# EAGLE design delay_calibrator (EAGLE 9.2.2)
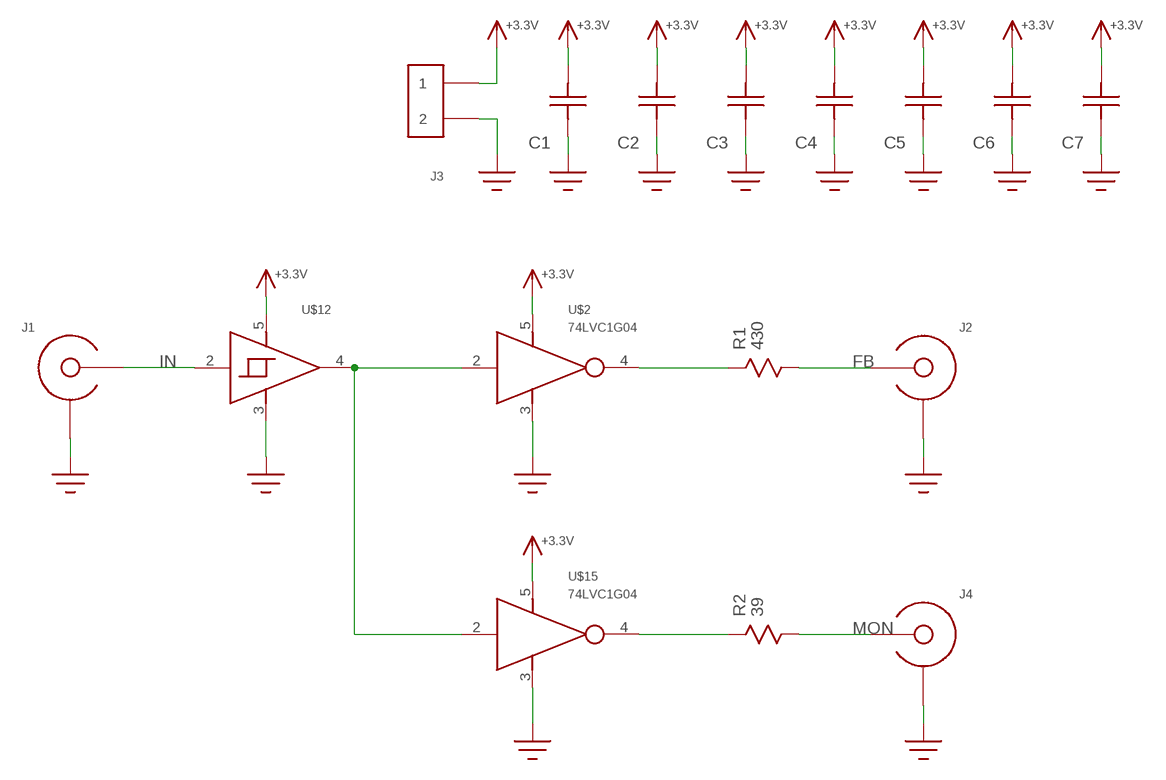
[diagram p0: schematic, sheet 1]

## Parts
C1  C1206  [1206]
C2  C0603  [C0603]
C3  C0603  [C0603]
C4  C0603  [C0603]
C5  C0603  [C0603]
C6  C0603  [C0603]
C7  C0603  [C0603]
J1  EDGE_LAUNCH_JACK  [EDGE_LAUNCH_RF_CON]
J2  EDGE_LAUNCH_JACK  [EDGE_LAUNCH_RF_CON]
J3  HEADER_2PIN  [HEADER_2PIN]
J4  EDGE_LAUNCH_JACK  [EDGE_LAUNCH_RF_CON]
R1  430  R0603  [R0603]
R2  39  R0603  [R0603]
U$2  74LVC1G04  [SOT23-5]
U$12  74LVC1G17  [SOT23-5]
U$15  74LVC1G04  [SOT23-5]

## Nets
+3.3V: C1.P$1 C2.P$1 C3.P$1 C4.P$1 C5.P$1 C6.P$1 C7.P$1 J3.1 U$2.5(VCC) U$12.5(VCC) U$15.5(VCC)
FB: J2.CENTER R1.P$2
GND: C1.P$2 C2.P$2 C3.P$2 C4.P$2 C5.P$2 C6.P$2 C7.P$2 J1.GND@1(SHIELD) J1.GND@2(SHIELD) J1.GND@3(SHIELD) J1.GND@4(SHIELD) J1.GND@5(SHIELD) J1.GND@6(SHIELD) J1.GND@7(SHIELD) J1.GND@8(SHIELD) J1.GND@9(SHIELD) J1.GND@10(SHIELD) J1.GND@11(SHIELD) J1.GND@12(SHIELD) J1.SHIELD@1(SHIELD) J1.SHIELD@2(SHIELD) J2.GND@1(SHIELD) J2.GND@2(SHIELD) J2.GND@3(SHIELD) J2.GND@4(SHIELD) J2.GND@5(SHIELD) J2.GND@6(SHIELD) J2.GND@7(SHIELD) J2.GND@8(SHIELD) J2.GND@9(SHIELD) J2.GND@10(SHIELD) J2.GND@11(SHIELD) J2.GND@12(SHIELD) J2.SHIELD@1(SHIELD) J2.SHIELD@2(SHIELD) J3.2 J4.GND@1(SHIELD) J4.GND@2(SHIELD) J4.GND@3(SHIELD) J4.GND@4(SHIELD) J4.GND@5(SHIELD) J4.GND@6(SHIELD) J4.GND@7(SHIELD) J4.GND@8(SHIELD) J4.GND@9(SHIELD) J4.GND@10(SHIELD) J4.GND@11(SHIELD) J4.GND@12(SHIELD) J4.SHIELD@1(SHIELD) J4.SHIELD@2(SHIELD) U$2.3(GND) U$12.3(GND) U$15.3(GND)
IN: J1.CENTER U$12.2(IN)
MON: J4.CENTER R2.P$2
N$3: R2.P$1 U$15.4(OUT)
N$4: R1.P$1 U$2.4(OUT)
N$7: U$2.2(IN) U$12.4(OUT) U$15.2(IN)

## Library data of the parts
C1-C7 = yapo:C
J1 J2 J4 = yapo:EDGE_LAUNCH_JACK
J3 = yapo:HEADER_2PIN
R1 R2 = yapo:R
U$2 U$15 = yapo:74LVC1G04
U$12 = yapo:74LVC1G17

## Board
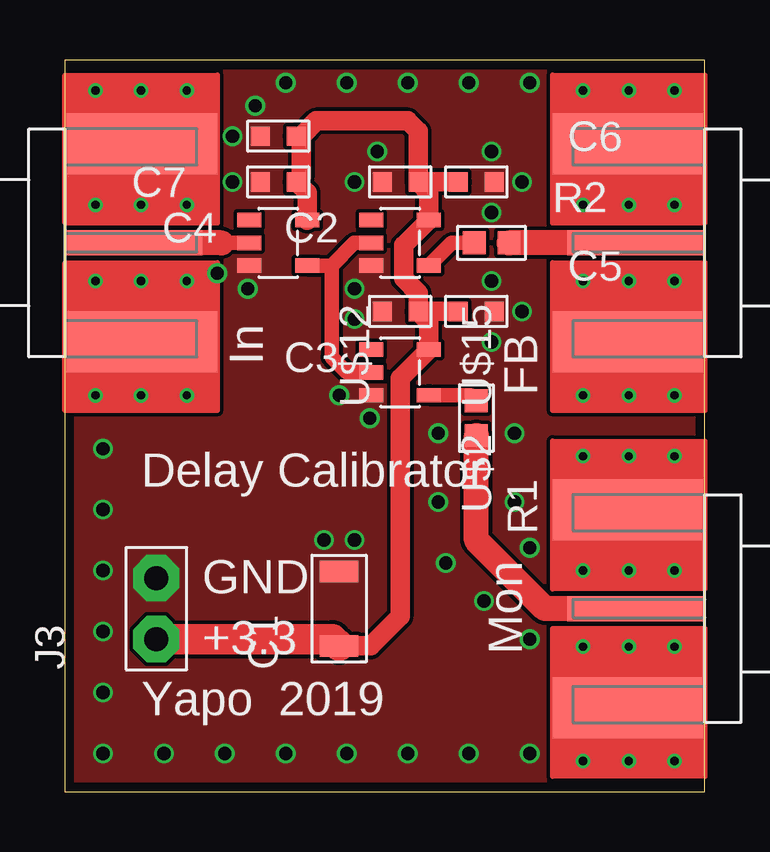
[diagram p1: board, top side]
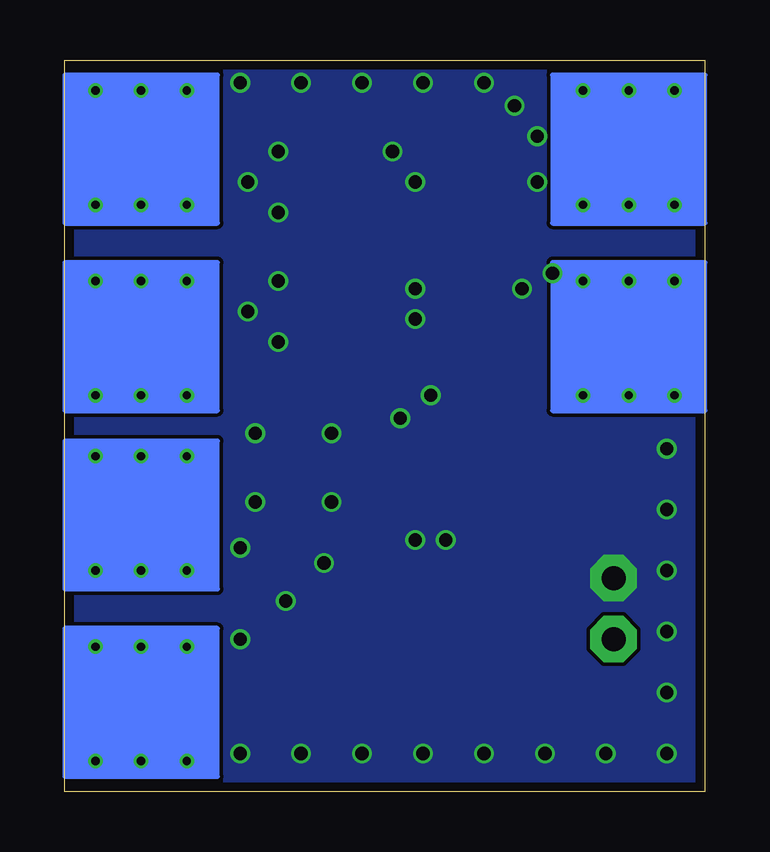
[diagram p2: board, bottom side, seen from below]

Size 26.67 x 30.48 mm. Coordinates in mm from the lower left corner, seen from the top.
Outline: 0,0 26.67,0 26.67,30.48 0,30.48 0,0
Copper layers (1*16): Top 0.035559375mm / dielectric 1.6mm / Bottom 0.035559375mm
Design rules "oshpark-2layer *": minimum track width 6mil, minimum drill 10mil, track to track 6mil, track to pad 6mil, pad to pad 6mil, via to via 6mil, smd to smd 6mil, copper to edge 15mil, drill to drill 6mil, minimum pad ring 5mil, minimum via ring 5mil, stop-mask expansion 2.5mil, vias tented up to drill 30mil, thermal gap 10mil

### Footprints (pad centres in the part's own frame; a part is rotated, then mirrored left to right if it is on the bottom)
1206 = smd 0.9 x 1.6: P$1 -1.55,0; P$2 1.55,0
C0603 = smd 0.8 x 0.8: P$1 -0.75,0; P$2 0.75,0
EDGE_LAUNCH_RF_CON = smd 5.715 x 1.041: CENTER -2.875,0 | drill 0.35: GND@1 -5.08,1.587; GND@2 -3.175,1.587; GND@3 -1.27,1.587; GND@4 -5.08,-1.587; GND@5 -3.175,-1.587; GND@6 -1.27,-1.587; GND@7 -5.08,6.35; GND@8 -3.175,6.35; GND@9 -1.27,6.35; GND@10 -5.08,-6.35; GND@11 -3.175,-6.35; GND@12 -1.27,-6.35 | smd 6.35 x 2.54: SHIELD@1 -3.175,-4.128; SHIELD@2 -3.175,4.128
HEADER_2PIN = drill 1 pad 1.93 octagon: 1 -1.27,0; 2 1.27,0
R0603 = smd 0.95 x 0.95: P$1 -0.725,0; P$2 0.725,0
SOT23-5 = smd 0.6 x 1: 1 -0.95,-1.2; 2 0,-1.2; 3 0.95,-1.2; 4 0.95,1.2; 5 -0.95,1.2

### Placement (x,y rotation side)
C1  11.43,7.62 90 top
C2  13.97,25.4 180 top
C3  13.97,20 180 top
C4  8.89,25.4 180 top
C5  17.14,20 0 top
C6  17.14,25.4 0 top
C7  8.89,27.3 180 top
J1  0,22.86 180 top
J2  26.67,7.62 0 top
J3  3.81,7.62 90 top
J4  26.67,22.86 0 top
R1  17.14,15.56 270 top
R2  17.78,22.86 0 top
U$2  13.97,17.46 270 top
U$12  8.89,22.86 270 top
U$15  13.97,22.86 270 top

### Tracks (layer width: path | path; a pad name or v marks a point on that pad's centre or on a via)
+3.3V
  Top 0.813: U$12.5 10.09,24.95 C4.P$1 9.84,25.6 9.84,27.3 | C2.P$1 15.17,24.95 U$15.5 14.11,22.75 14.11,21.38 14.72,20.77 C3.P$1 | C3.P$1 15.17,19.55 U$2.5 13.97,17.21 13.97,7.3 12.74,6.07 C1.P$1 | C2.P$1 14.72,27.51 14.29,27.94 10.48,27.94 9.84,27.3 | C7.P$1 9.84,27.3 | C6.P$1 C2.P$1 | C5.P$1 C3.P$1
  Top 1.27: J3.1 11.15,6.35 C1.P$1
FB
  Top 1.041: J2.CENTER 20,7.62 17.14,10.48 R1.P$2
GND  (via drill 0.55)
  other vias: 6.99,27.3 6.99,25.4 7.62,20.95 12.06,25.4 19.05,25.4 19.05,20 12.06,19.68 12.7,15.56 12.06,20.95 6.35,21.59 11.43,16.51 7.94,28.57 13.02,26.67 17.78,26.67 17.78,18.73 17.78,21.27 17.78,24.13 12.06,10.48 10.79,10.48 18.73,14.92 15.56,14.92 15.56,12.06 18.73,12.06 19.37,10.16 15.88,9.53 17.46,7.94 19.37,6.35 1.59,1.59 4.13,1.59 6.67,1.59 9.21,1.59 11.75,1.59 14.29,1.59 16.83,1.59 19.37,1.59 1.59,4.13 1.59,6.67 1.59,9.21 1.59,11.75 1.59,14.29 19.37,29.53 16.83,29.53 14.29,29.53 11.75,29.53 9.21,29.53
  pour Top (no thermals): 0,0 26.67,0 26.67,30.48 0,30.48
  pour Bottom (no thermals): 0,0 26.67,0 26.67,30.48 0,30.48
IN
  Top 0.61: U$12.2 6.52,22.86
  Top 1.041: 6.52,22.86 J1.CENTER
MON
  Top 1.041: J4.CENTER R2.P$2
N$3
  Top 0.61: U$15.4 16.12,22.86 R2.P$1
N$4
  Top 0.61: U$2.4 16.91,16.51 R1.P$1
N$7
  Top 0.61: U$12.4 11.12,21.91 | 11.12,21.91 12.06,22.86 U$15.2 | 11.12,21.91 11.12,18.09 11.75,17.46 U$2.2

### Text on the board
tPlace: In | FB | Delay Calibrator | GND | +3.3 | Mon | Yapo | 2019